# Altium project SCM.PrjPcb (part 2 of 2)

## Sheet Outputs.SchDoc
size A; SheetNumber: 8; SheetTotal: 10
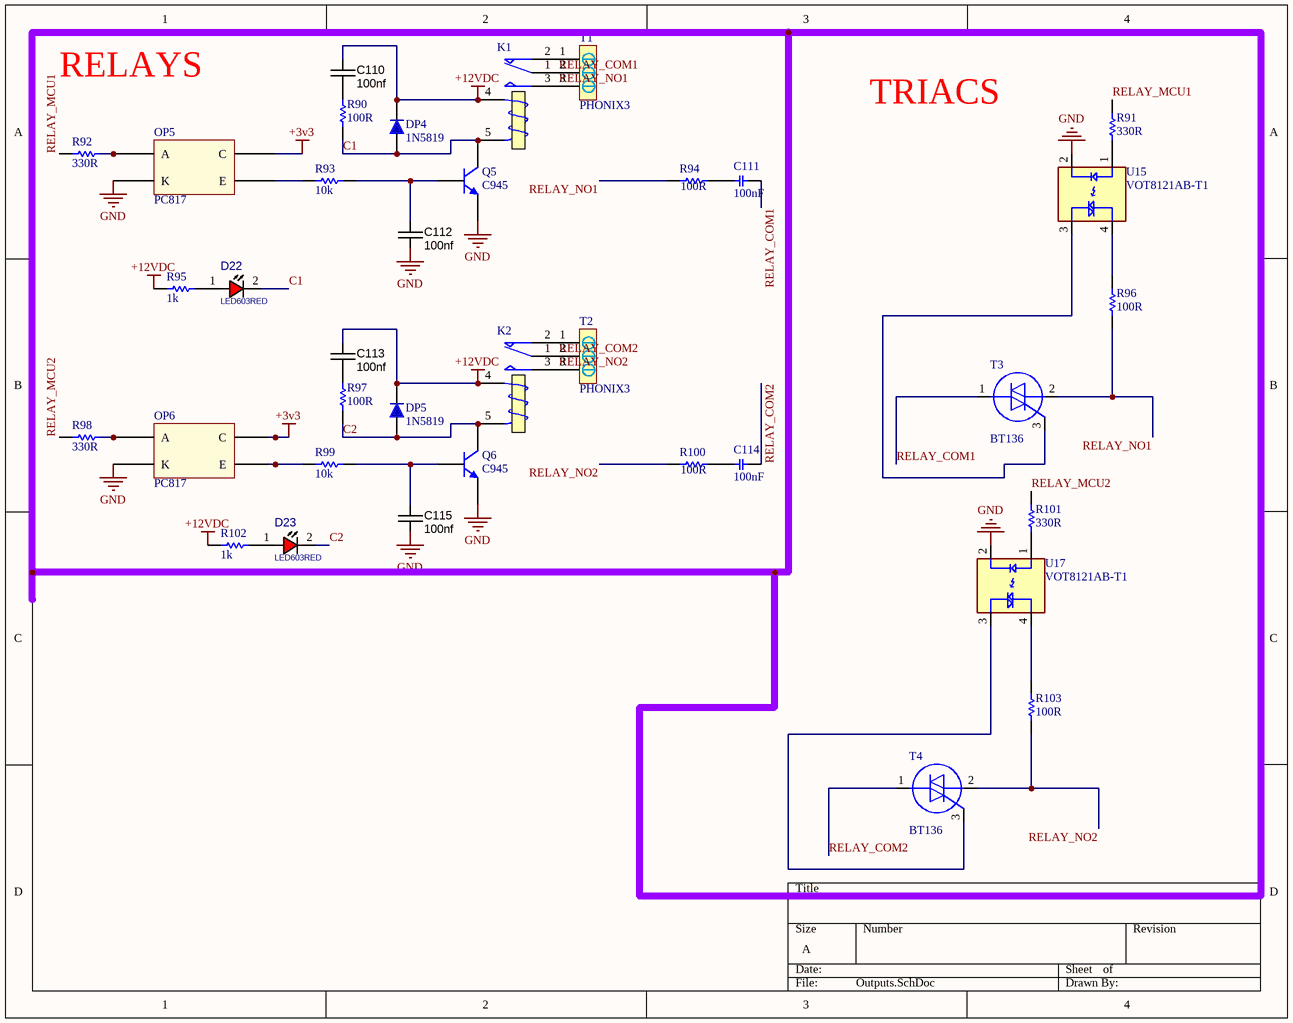
[diagram p7: Outputs.SchDoc]

### Parts
C110  100nf  [CAPC1608X90N]
C111  100nF  [Cap - 10nF - 630V]
C112  100nf  [CAPC1608X90N]
C113  100nf  [CAPC1608X90N]
C114  100nF  [Cap - 10nF - 630V]
C115  100nf  [CAPC1608X90N]
D22  LED603RED  [LED0603RED]
D23  LED603RED  [LED0603RED]
DP4  1N5819  [430X270D]
DP5  1N5819  [430X270D]
K1  (no value)  [Relay 18.85x15.35x15.70]
K2  (no value)  [Relay 18.85x15.35x15.70]
OP5  PC817  [PC817 SMD]
OP6  PC817  [PC817 SMD]
Q5  C945  [SOT23_N]
Q6  C945  [SOT23_N]
R90  100R  [Resistor_SMD_0603 (1608)]
R91  330R  [Resistor_SMD_0603 (1608)]
R92  330R  [Resistor_SMD_0603 (1608)]
R93  10k  [Resistor_SMD_0603 (1608)]
R94  100R  [RES2512]
R95  1k  [Resistor_SMD_0603 (1608)]
R96  100R  [RES2512]
R97  100R  [Resistor_SMD_0603 (1608)]
R98  330R  [Resistor_SMD_0603 (1608)]
R99  10k  [Resistor_SMD_0603 (1608)]
R100  100R  [RES2512]
R101  330R  [Resistor_SMD_0603 (1608)]
R102  1k  [Resistor_SMD_0603 (1608)]
R103  100R  [RES2512]
T1  PHONIX3  [PHONIX3]
T2  PHONIX3  [PHONIX3]
T3  BT136  [TO252]
T4  BT136  [TO252]
U15  VOT8121AB-T1  [SOIC254P1016X440-4N]
U17  VOT8121AB-T1  [SOIC254P1016X440-4N]

### Nets
+3V3: OP5.4(C) OP6.4(C)
+12VDC: C110.2 C113.2 DP4.2 DP5.2 K1.4(T1) K2.4(T1) R95.1 R102.1
GND: C112.1 C115.1 OP5.2(K) OP6.2(K) Q5.2(E) Q6.2(E) U15.2(C) U17.2(C)
C1: D22.2(CATHODE) DP4.1 K1.5(T2) Q5.3(C) R90.2
C2: D23.2(CATHODE) DP5.1 K2.5(T2) Q6.3(C) R97.2
RELAY_COM1: C111.1 K1.1(COM) T1.2 T3.1(MT1)
RELAY_COM2: C114.1 K2.1(COM) T2.2 T4.1(MT1)
RELAY_MCU1: R91.1 R92.1
RELAY_MCU2: R98.1 R101.1
RELAY_NO1: K1.3(NO) R94.2 R96.1 T1.3 T3.2(MT2)
RELAY_NO2: K2.3(NO) R100.2 R103.1 T2.3 T4.2(MT2)
NetC110_1: C110.1 R90.1
NetC111_2: C111.2 R94.1
NetC112_2: C112.2 Q5.1(B) R93.2
NetC113_1: C113.1 R97.1
NetC114_2: C114.2 R100.1
NetC115_2: C115.2 Q6.1(B) R99.2
NetD22_1: D22.1(ANODE) R95.2
NetD23_1: D23.1(ANODE) R102.2
NetK1_2: K1.2(NC) T1.1
NetK2_2: K2.2(NC) T2.1
NetOP5_1: OP5.1(A) R92.2
NetOP5_3: OP5.3(E) R93.1
NetOP6_1: OP6.1(A) R98.2
NetOP6_3: OP6.3(E) R99.1
NetR91_2: R91.2 U15.1(A)
NetR96_2: R96.2 U15.4(MT2)
NetR101_2: R101.2 U17.1(A)
NetR103_2: R103.2 U17.4(MT2)
NetT3_3: T3.3(G) U15.3(MT1)
NetT4_3: T4.3(G) U17.3(MT1)

### Notes on the sheet
- RELAYS
- TRIACS

### Library data of the parts
C110 C112 C113 C115 = CAPC_100n_0603_X7R_50V_10%: Capacitor SMD Cer 100nF 10% 50V X7R 0603; Manufacturer 1: AVX Corporation; Manufacturer Part Number 1: 06035C104KAT2A; Ratings: 50V; X7R; Material: ceramic; SCDType: spec; Value: 100n; Manufacturer 2: TDK Corporation; Manufacturer Part Number 2: C1608X7R1H104K; Package / Case: 0603 (1608 Metric); Tolerance: ±10%; Supplier 1: Digi-Key; Supplier Part Number 1: 478-5052-1-ND; ComponentLink1URL: http://www.avx.com/docs/Catalogs/cx7r.pdf; ComponentLink1Description: http://www.avx.com/docs/Catalogs/cx7r.pdf; Supplier 2: Digi-Key; Supplier Part Number 2: 445-1314-1-ND; ComponentLink2URL: http://product.tdk.com/capacitor/mlcc/en/documents/mlcc_commercial_general_en.pdf; ComponentLink2Description: http://product.tdk.com/capacitor/mlcc/en/documents/mlcc_commercial_general_en.pdf
C111 C114 = Capacitor Polyester THD: DatasheetVersion: 2021; ComponentLink1Description: Website Smart World; ComponentLink1URL: https://www.smartw.ir/; ComponentLink2Description: Telegram; ComponentLink2URL: https://t.me/altium_smartw; ComponentLink3Description: Instagram; ComponentLink3URL: https://Instagram.com/smartgw.ir; Value: 100nF
D22 D23 = LED_SMD_0603_RED: LED, SMD, 0603, RED; PARAM: 30mA, 640nm; DESC: DESCRIPTION; MANF_P#: MANF_PART#; PARAM2: 1.8~2.5V; MANF: MANF; ASSEMBLY: ASSEMBLY; PRICE: PRICE; VALUE: LED603RED
DP4 DP5 = 1N5819: Schottkey Rectifiers; Designer: Abbas Basereh; Data: 16-12-2016; Link: *; Part. No: *
K1 K2 = Relay_SPDT: Single-Pole Dual-Throw Relay; Designer: Abbas Basereh; Mounting Technology: Through-Hole; ComponentLink1Description: Datasheet; Pin Count: 0; Update Date: 2017-3-1
OP5 OP6 = PC817: PC817 optocpler; ComponentLink2Description: Website Smart World; ComponentLink2URL: https://www.smartw.ir/; ComponentLink3Description: Telegram; ComponentLink3URL: https://t.me/altium_smartw; ComponentLink4Description: Instagram; ComponentLink4URL: https://Instagram.com/smartgw.ir; DatasheetVersion: 2021
Q5 Q6 = C945: NPN Silicon Epitaxial Planar Transistor; Published: 2017-2-8; LatestRevisionDate: 2017; LatestRevisionNote: IPC-7351 Footprint Added.; DatasheetVersion: 2017; PackageVersion: 2017-2-8; PackageReference: SOT23; Publisher: Abbas Basereh; PackageDescription: 3-Pin SOT-23 Package 0.95 mm Pitch, 2.3 mm Lead Span; ComponentLink1Description: Manufacturer Link; ComponentLink1URL: http://www.taitroncomponents.com/; ComponentLink2Description: Datasheet; ComponentLink2URL: http://www.taitroncomponents.com/
R90 = Resistor: Resistor 0603; Email: razi.vesali@gmail.com; Value: 10k; Published: 17-Jun-2016; LatestRevisionNote: Re-released for puplic; Publisher: Seyed Razi Vesali
R91 R101 = Resistor: Resistor0603; Email: razi.vesali@gmail.com; Value: 10k; Published: 17-Jun-2016; LatestRevisionNote: Re-released for puplic; Publisher: Seyed Razi Vesali
R92 R95 R97 R98 R102 = Resistor: Email: razi.vesali@gmail.com; Value: 10k; Published: 17-Jun-2016; LatestRevisionNote: Re-released for puplic; Publisher: Seyed Razi Vesali
R93 = Resistor: as R15 on sheet Power; Published: 17-Jun-2016; LatestRevisionNote: Re-released for puplic; Publisher: Seyed Razi Vesali; Value: 10k
R94 R100 = RES SMD PACKAGE: TOTAL SMD RESISTOR PACK 2512; Designer: Abbas Basereh; Desc.: RES SMD PAKAGES; VALUE: 1K; Data: 2017-3-10
R96 R103 = RES SMD PACKAGE: 2512; Designer: Abbas Basereh; Desc.: RES SMD PAKAGES; VALUE: 1K; Data: 2017-3-10
R99 = Resistor: Email: razi.vesali@gmail.com; Published: 17-Jun-2016; LatestRevisionNote: Re-released for puplic; Publisher: Seyed Razi Vesali; Value: 10k
T3 T4 = BT136X-600E,127: Triac; Manufacturer_Name: WeEn Semiconductors; Datasheet Link: http://www.ween-semi.com/documents/BT136X-600E.pdf?t=636677005870193107; Height: 4.6mm; Manufacturer_Part_Number: BT136X-600E,127; Arrow Part Number: BT136X-600E,127; Arrow Price/Stock: https://www.arrow.com/en/products/bt136x-600e127/ween-semiconductors; Mouser Part Number: 771-BT136X-600E127; Mouser Price/Stock: https://www.mouser.co.uk/ProductDetail/WeEn-Semiconductors/BT136X-600E127?qs=me8TqzrmIYUnGFKHK14Rew%3D%3D
U15 U17 = VOT8121AB-T1: Optoisolator Triac Output 5300Vrms 1 Channel 4-SMD; MF: Vishay Semiconductor Opto Division; SnapEDA_Link: https://www.snapeda.com/parts/VOT8121AB-T1/Vishay/view-part/?ref=snap; Package: SMD-4 Vishay; Value: *; MP: VOT8121AB-T1; Check_prices: https://www.snapeda.com/parts/VOT8121AB-T1/Vishay/view-part/?ref=eda

## Sheet Power2.SchDoc
size A; SheetNumber: 9; SheetTotal: 10
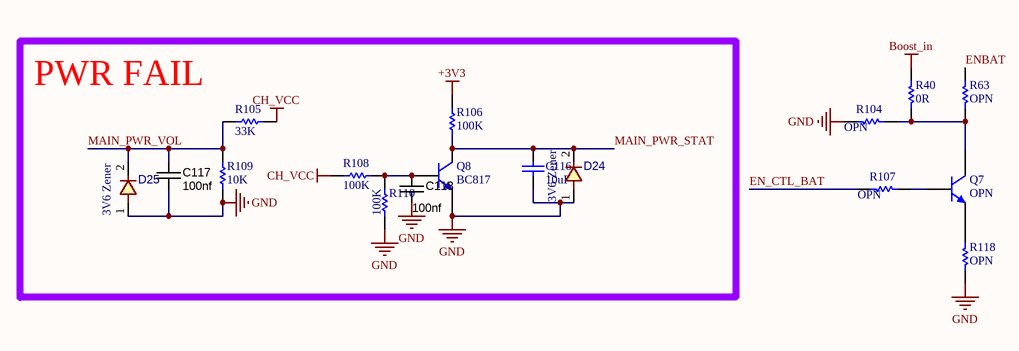
[diagram p8: Power2.SchDoc]

### Parts
C116  10uF  [CAPC3413X12N]
C117  100nf  [CAPC1608X90N]
C118  100nf  [CAPC1608X90N]
D24  value 3V6 Zener  [D_SOD80]  (hidden comment: 5Z1)
D25  value 3V6 Zener  [D_SOD80]  (hidden comment: 5Z1)
Q7  OPN  [SOT23_N]
Q8  BC817  [SOT23_N]
R40  0R  [R0603]
R63  OPN  [R0603]
R104  OPN  [R0603]
R105  33K  [Resistor_SMD_0603 (1608)]
R106  100K  [Resistor_SMD_0603 (1608)]
R107  OPN  [R0603]
R108  100K  [Resistor_SMD_0603 (1608)]
R109  10K  [Resistor_SMD_0603 (1608)]
R110  100K  [Resistor_SMD_0603 (1608)]
R118  OPN  [R0603]

### Nets
+3V3: R106.1
Boost_in: R40.1
CH_VCC: R105.2 R108.1
GND: C116.1 C117.2 C118.2 D24.1 D25.1 Q8.2(E) R104.2 R109.1 R110.1 R118.2
EN_CTL_BAT: R107.2
ENBAT: R63.1
MAIN_PWR_STAT: C116.2 D24.2 Q8.3(C) R106.2
MAIN_PWR_VOL: C117.1 D25.2 R105.1 R109.2
NetC118_1: C118.1 Q8.1(B) R108.2 R110.2
NetQ7_1: Q7.1(B) R107.1
NetQ7_2: Q7.2(E) R118.1
NetQ7_3: Q7.3(C) R40.2 R63.2 R104.1

### Notes on the sheet
- PWR FAIL

### Library data of the parts
C116 = CAP SMD 0805: CAP 0805; Designer: Abbas Basereh; Desc.: CAP SMD 0805; Data: 16-12-2016
C117 C118 = CAPC_100n_0603_X7R_50V_10%: as C110 on sheet Outputs; Manufacturer 2: TDK Corporation; Manufacturer Part Number 2: C1608X7R1H104K; Package / Case: 0603 (1608 Metric); Tolerance: ±10%; Supplier 1: Digi-Key; Supplier Part Number 1: 478-5052-1-ND; ComponentLink1URL: http://www.avx.com/docs/Catalogs/cx7r.pdf; ComponentLink1Description: http://www.avx.com/docs/Catalogs/cx7r.pdf; Supplier 2: Digi-Key; Supplier Part Number 2: 445-1314-1-ND; ComponentLink2URL: http://product.tdk.com/capacitor/mlcc/en/documents/mlcc_commercial_general_en.pdf; ComponentLink2Description: http://product.tdk.com/capacitor/mlcc/en/documents/mlcc_commercial_general_en.pdf
D24 D25 = 1N4148 SMD: DIODE, FAST SWTICHING, 0.3A, 0.5W
Q7 Q8 = C945: NPN Silicon Epitaxial Planar Transistor; Published: 2017-2-8; LatestRevisionDate: 2017; LatestRevisionNote: IPC-7351 Footprint Added.; DatasheetVersion: 2017; PackageVersion: 2017-2-8; PackageReference: SOT23; Publisher: Abbas Basereh; PackageDescription: 3-Pin SOT-23 Package 0.95 mm Pitch, 2.3 mm Lead Span; ComponentLink1Description: Manufacturer Link; ComponentLink1URL: http://www.taitroncomponents.com/; ComponentLink2Description: Datasheet; ComponentLink2URL: http://www.taitroncomponents.com/
R40 R63 R104 R107 R118 = Resistor SMD 0603
R105 R106 R108 R110 = Resistor: as R90 on sheet Outputs; Published: 17-Jun-2016; LatestRevisionNote: Re-released for puplic; Publisher: Seyed Razi Vesali
R109 = Resistor: Resistor0603; Email: razi.vesali@gmail.com; Published: 17-Jun-2016; LatestRevisionNote: Re-released for puplic; Publisher: Seyed Razi Vesali; Value: 10k

## Sheet memory.SchDoc
size A; SheetNumber: 10; SheetTotal: 10
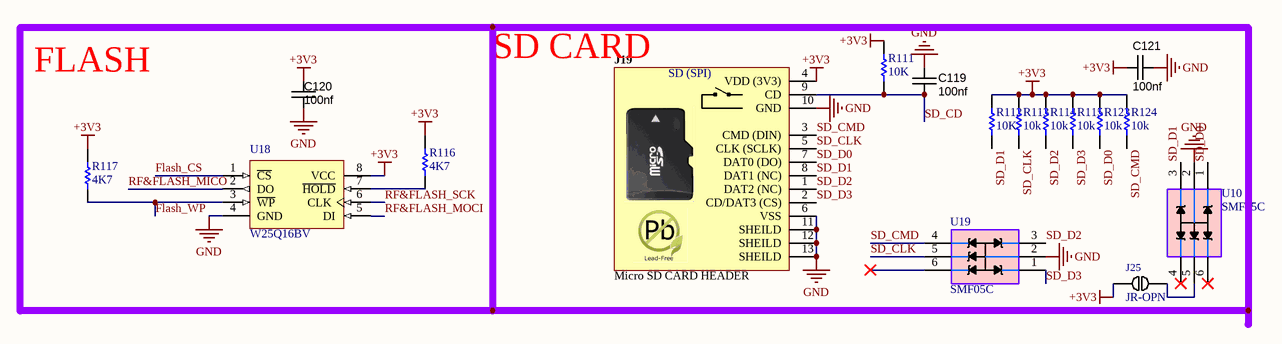
[diagram p9: memory.SchDoc]

### Parts
C119  100nf  [CAPC1608X90N]
C120  100nf  [CAPC1608X90N]
C121  100nf  [CAPC1608X90N]
J19  Micro SD CARD HEADER  [SMD_CON_Micro SD -Push-Push]
J25  JR-OPN
R111  10K  [Resistor_SMD_0603 (1608)]
R112  10K  [Resistor_SMD_0603 (1608)]
R113  10k  [Resistor_SMD_0603 (1608)]
R114  10k  [Resistor_SMD_0603 (1608)]
R115  10k  [Resistor_SMD_0603 (1608)]
R116  4K7  [Resistor_SMD_0603 (1608)]
R117  4K7  [Resistor_SMD_0603 (1608)]
R123  10k  [Resistor_SMD_0603 (1608)]
R124  10k  [Resistor_SMD_0603 (1608)]
U10  SMF05C  [SC706]
U18  W25Q16BV  [SO08]
U19  SMF05C  [SC706]

### Nets
+3V3: C120.2 C121.2 J19.4(VDD_(3V3)) J25.2 R111.1 R112.1 R113.1 R114.1 R115.1 R116.1 R117.1 R123.1 R124.1 U18.8(VCC)
GND: C119.1 C120.1 C121.1 J19.6(VSS) J19.10(GND) J19.11(SHEILD) J19.12(SHEILD) J19.13(SHEILD) U10.2(Gnd) U18.4(GND) U19.2(Gnd)
Flash_CS: U18.1(~{CS})
Flash_WP: R117.2 U18.3(~{WP})
RF&FLASH_MICO: U18.2(DO)
RF&FLASH_MOCI: U18.5(DI)
RF&FLASH_SCK: U18.6(CLK)
SD_CD: C119.2 J19.9(CD) R111.2
SD_CLK: J19.5(CLK_(SCLK)) R113.2 U19.5(L5)
SD_CMD: J19.3(CMD_(DIN)) R124.2 U19.4(L4)
SD_D0: J19.7(DAT0_(DO)) R123.2 U10.1(L1)
SD_D1: J19.8(DAT1_(NC)) R112.2 U10.3(L3)
SD_D2: J19.1(DAT2_(NC)) R114.2 U19.3(L3)
SD_D3: J19.2(CD/DAT3_(CS)) R115.2 U19.1(L1)
NetJ25_1: J25.1 U10.5(L5)
NetR116_2: R116.2 U18.7(~{HOLD})

Not connected (* = marked no-connect by the designer): U10 4(L4)* 6(L6)*; U19 6(L6)*

### Notes on the sheet
- FLASH
- SD CARD
- (in symbol CON_Micro SD) SD (SPI)

### Library data of the parts
C119-C121 = CAPC_100n_0603_X7R_50V_10%: as C110 on sheet Outputs; Manufacturer 2: TDK Corporation; Manufacturer Part Number 2: C1608X7R1H104K; Package / Case: 0603 (1608 Metric); Tolerance: ±10%; Supplier 1: Digi-Key; Supplier Part Number 1: 478-5052-1-ND; ComponentLink1URL: http://www.avx.com/docs/Catalogs/cx7r.pdf; ComponentLink1Description: http://www.avx.com/docs/Catalogs/cx7r.pdf; Supplier 2: Digi-Key; Supplier Part Number 2: 445-1314-1-ND; ComponentLink2URL: http://product.tdk.com/capacitor/mlcc/en/documents/mlcc_commercial_general_en.pdf; ComponentLink2Description: http://product.tdk.com/capacitor/mlcc/en/documents/mlcc_commercial_general_en.pdf
J19 = CON_Micro SD: Secure Digital Card Socket; Max Current: mA; designer: Eng. Saeid Jorablo; Company: SJ Libraries; Connector type: Header; Mounting Technology: Surface Mount; Status: Unreleased; Category: Connector; Pin Count: 13; Publisher: SJ UnLimited; ComponentLink1Description: Datasheet; ComponentLink2Description: Reference; Update: 7/8/2012; HelpURL: http://s3.picofile.com/file/7443264187/Coming_Soon_logo.gif
J25 = BYPASS: SOLDERDOT BYPASS; Manufacturer Part Number 1: Board Feature; Reel: Open; Supplier 1: Solder-it-yourself; Manufacturer 1: Board feature
R111-R115 R123 R124 = Resistor: as R15 on sheet Power; Published: 17-Jun-2016; LatestRevisionNote: Re-released for puplic; Publisher: Seyed Razi Vesali; Value: 10k
R116 R117 = Resistor: as R90 on sheet Outputs; Published: 17-Jun-2016; LatestRevisionNote: Re-released for puplic; Publisher: Seyed Razi Vesali
U10 U19 = TVS Diode: TVS Diode Array  For ESD and Latch-Up Protection
U18 = W25Q16BV: Flash, pin, soic, flash, Memory, Semiconductors and Actives, serial, ic; ComponentLink1Description: Website: Tarahiboard; ComponentLink1URL: https://www.tarahiboard.com/; DatasheetVersion: 2022

## Nets that join several sheets
+3V3: Power (5 pins), MCU (14 pins), UI (S2.1 S3.1 S4.1), RF & wireless (8 pins), LAN (9 pins), sensors (15 pins), Outputs (OP5.4 OP6.4), Power2 (R106.1), memory (14 pins)
+5v SW: Power (11 pins), UI (9 pins), GSM (J7.1), RF & wireless (M1.3), sensors (14 pins)
+12VDC: Power (D26.1 F1.1 J1.1), Outputs (8 pins)
Boost_in: Power (7 pins), Power2 (R40.1)
CH_VCC: Power (5 pins), Power2 (R105.2 R108.1)
GND: Power (52 pins), MCU (22 pins), UI (25 pins), GSM (42 pins), RF & wireless (6 pins), LAN (28 pins), sensors (29 pins), Outputs (8 pins), Power2 (10 pins), memory (11 pins)
GSM_VBAT: Power (J3.1), GSM (12 pins)
ADC_sensor1: MCU (U2.24), sensors (C102.1 R67.1 R69.2)
ADC_sensor2: MCU (U2.18), sensors (C105.1 R72.1 R73.2)
BAT_VOL: Power (C20.1 D10.2 R14.1 R15.2), MCU (U2.17)
Buz_MCU: MCU (U2.91), UI (R38.1)
Digital_sensor1: MCU (U2.61), sensors (C106.1 R74.2 R76.1)
Digital_sensor2: MCU (U2.60), sensors (C107.1 R75.2 R77.1)
Digital_sensor3: MCU (U2.59), sensors (C108.1 R82.2 R84.1)
Digital_sensor4: MCU (U2.58), sensors (C109.1 R83.2 R86.1)
EN_CTL_BAT: MCU (U2.57), Power2 (R107.2)
ENBAT: Power (U1.11), Power2 (R63.1)
ESP_CH_PD: MCU (U2.7), RF & wireless (R48.2 U7.6)
ESP_GPIO0: MCU (U2.3), RF & wireless (R49.2 U7.3)
ESP_GPIO2: MCU (U2.5), RF & wireless (R50.2 U7.5)
ESP_RESET: MCU (U2.4), RF & wireless (R51.2 U7.4)
ESP_RX: MCU (U2.25), RF & wireless (U7.1)
ESP_TX: MCU (U2.26), RF & wireless (U7.8)
Flash_CS: MCU (U2.51), memory (U18.1)
Flash_WP: MCU (U2.62), memory (R117.2 U18.3)
GSM_netlight: MCU (U2.1), GSM (R42.1 U4.16)
GSM_PWR_KEY: MCU (U2.98), GSM (R41.1)
I2C_SCL: MCU (U2.47), sensors (P2.1 R126.1)
I2C_SDA: MCU (U2.48), sensors (P2.3 R125.1)
IRQ_RC522: MCU (U2.97), RF & wireless (J9.4)
key_A_MCU: MCU (U2.46), UI (U3.17)
key_B_MCU: MCU (U2.45), UI (U3.16)
key_C_MCU: MCU (U2.44), UI (U3.15)
key_D_MCU: MCU (U2.43), UI (U3.14)
keypad_IT: MCU (U2.34), UI (R26.1 U3.12)
LAN_INT: MCU (U2.33), LAN (U8.36)
LAN_MISO: MCU (U2.31), LAN (U8.34)
LAN_MOSI: MCU (U2.32), LAN (U8.35)
LAN_RST: MCU (U2.15), LAN (U8.37)
LAN_SCK: MCU (U2.30), LAN (U8.33)
LAN_SCS: MCU (U2.29), LAN (U8.32)
LCD_BL_MCU: MCU (U2.39), UI (R25.2)
LCD_D4: MCU (U2.38), UI (P11.11)
LCD_D5: MCU (U2.37), UI (P11.12)
LCD_D6: MCU (U2.36), UI (P11.13)
LCD_D7: MCU (U2.35), UI (P11.14)
LCD_EN: MCU (U2.40), UI (P11.6)
LCD_RS: MCU (U2.42), UI (P11.4)
LCD_RW: MCU (U2.41), UI (P11.5)
MAIN_PWR_STAT: MCU (U2.69), Power2 (C116.2 D24.2 Q8.3 R106.2)
MAIN_PWR_VOL: MCU (U2.16), Power2 (C117.1 D25.2 R105.1 R109.2)
MCU_LED1: MCU (U2.96), UI (R35.1)
MCU_LED2: MCU (U2.90), UI (R36.1)
MCU_LED3: MCU (U2.86), UI (R37.1)
MCU_RXD_GSM: MCU (U2.92), GSM (JP3.2 R43.1)
MCU_TXD_GSM: MCU (U2.93), GSM (JP3.3 U4.17)
One_Wire1: MCU (U2.67), sensors (R66.2 R68.1)
One_Wire2: MCU (U2.68), sensors (R70.2 R71.1)
PB_MCU1: MCU (U2.87), UI (C50.2 R33.1 S3.2)
PB_MCU2: MCU (U2.88), UI (C51.2 R34.1 S4.2)
PB_MCU3: MCU (U2.95), UI (C49.2 R32.1 S2.2)
RELAY_MCU1: MCU (U2.55), Outputs (R91.1 R92.1)
RELAY_MCU2: MCU (U2.56), Outputs (R98.1 R101.1)
REMOTE_RF: MCU (U2.23), RF & wireless (M1.4 M1.5)
RF&FLASH_MICO: MCU (U2.53), RF & wireless (J9.5), memory (U18.2)
RF&FLASH_MOCI: MCU (U2.54), RF & wireless (J9.6), memory (U18.5)
RF&FLASH_SCK: MCU (U2.52), RF & wireless (J9.7), memory (U18.6)
RF_ss: MCU (U2.63), RF & wireless (J9.8 R127.1)
RST_RC522: MCU (U2.2), RF & wireless (J9.2)
SD_CD: MCU (U2.77), memory (C119.2 J19.9 R111.2)
SD_CLK: MCU (U2.80), memory (J19.5 R113.2 U19.5)
SD_CMD: MCU (U2.83), memory (J19.3 R124.2 U19.4)
SD_D0: MCU (U2.65), memory (J19.7 R123.2 U10.1)
SD_D1: MCU (U2.66), memory (J19.8 R112.2 U10.3)
SD_D2: MCU (U2.78), memory (J19.1 R114.2 U19.3)
SD_D3: MCU (U2.79), memory (J19.2 R115.2 U19.1)